# Altium schematic sheet Sch3.SchDoc
size A3
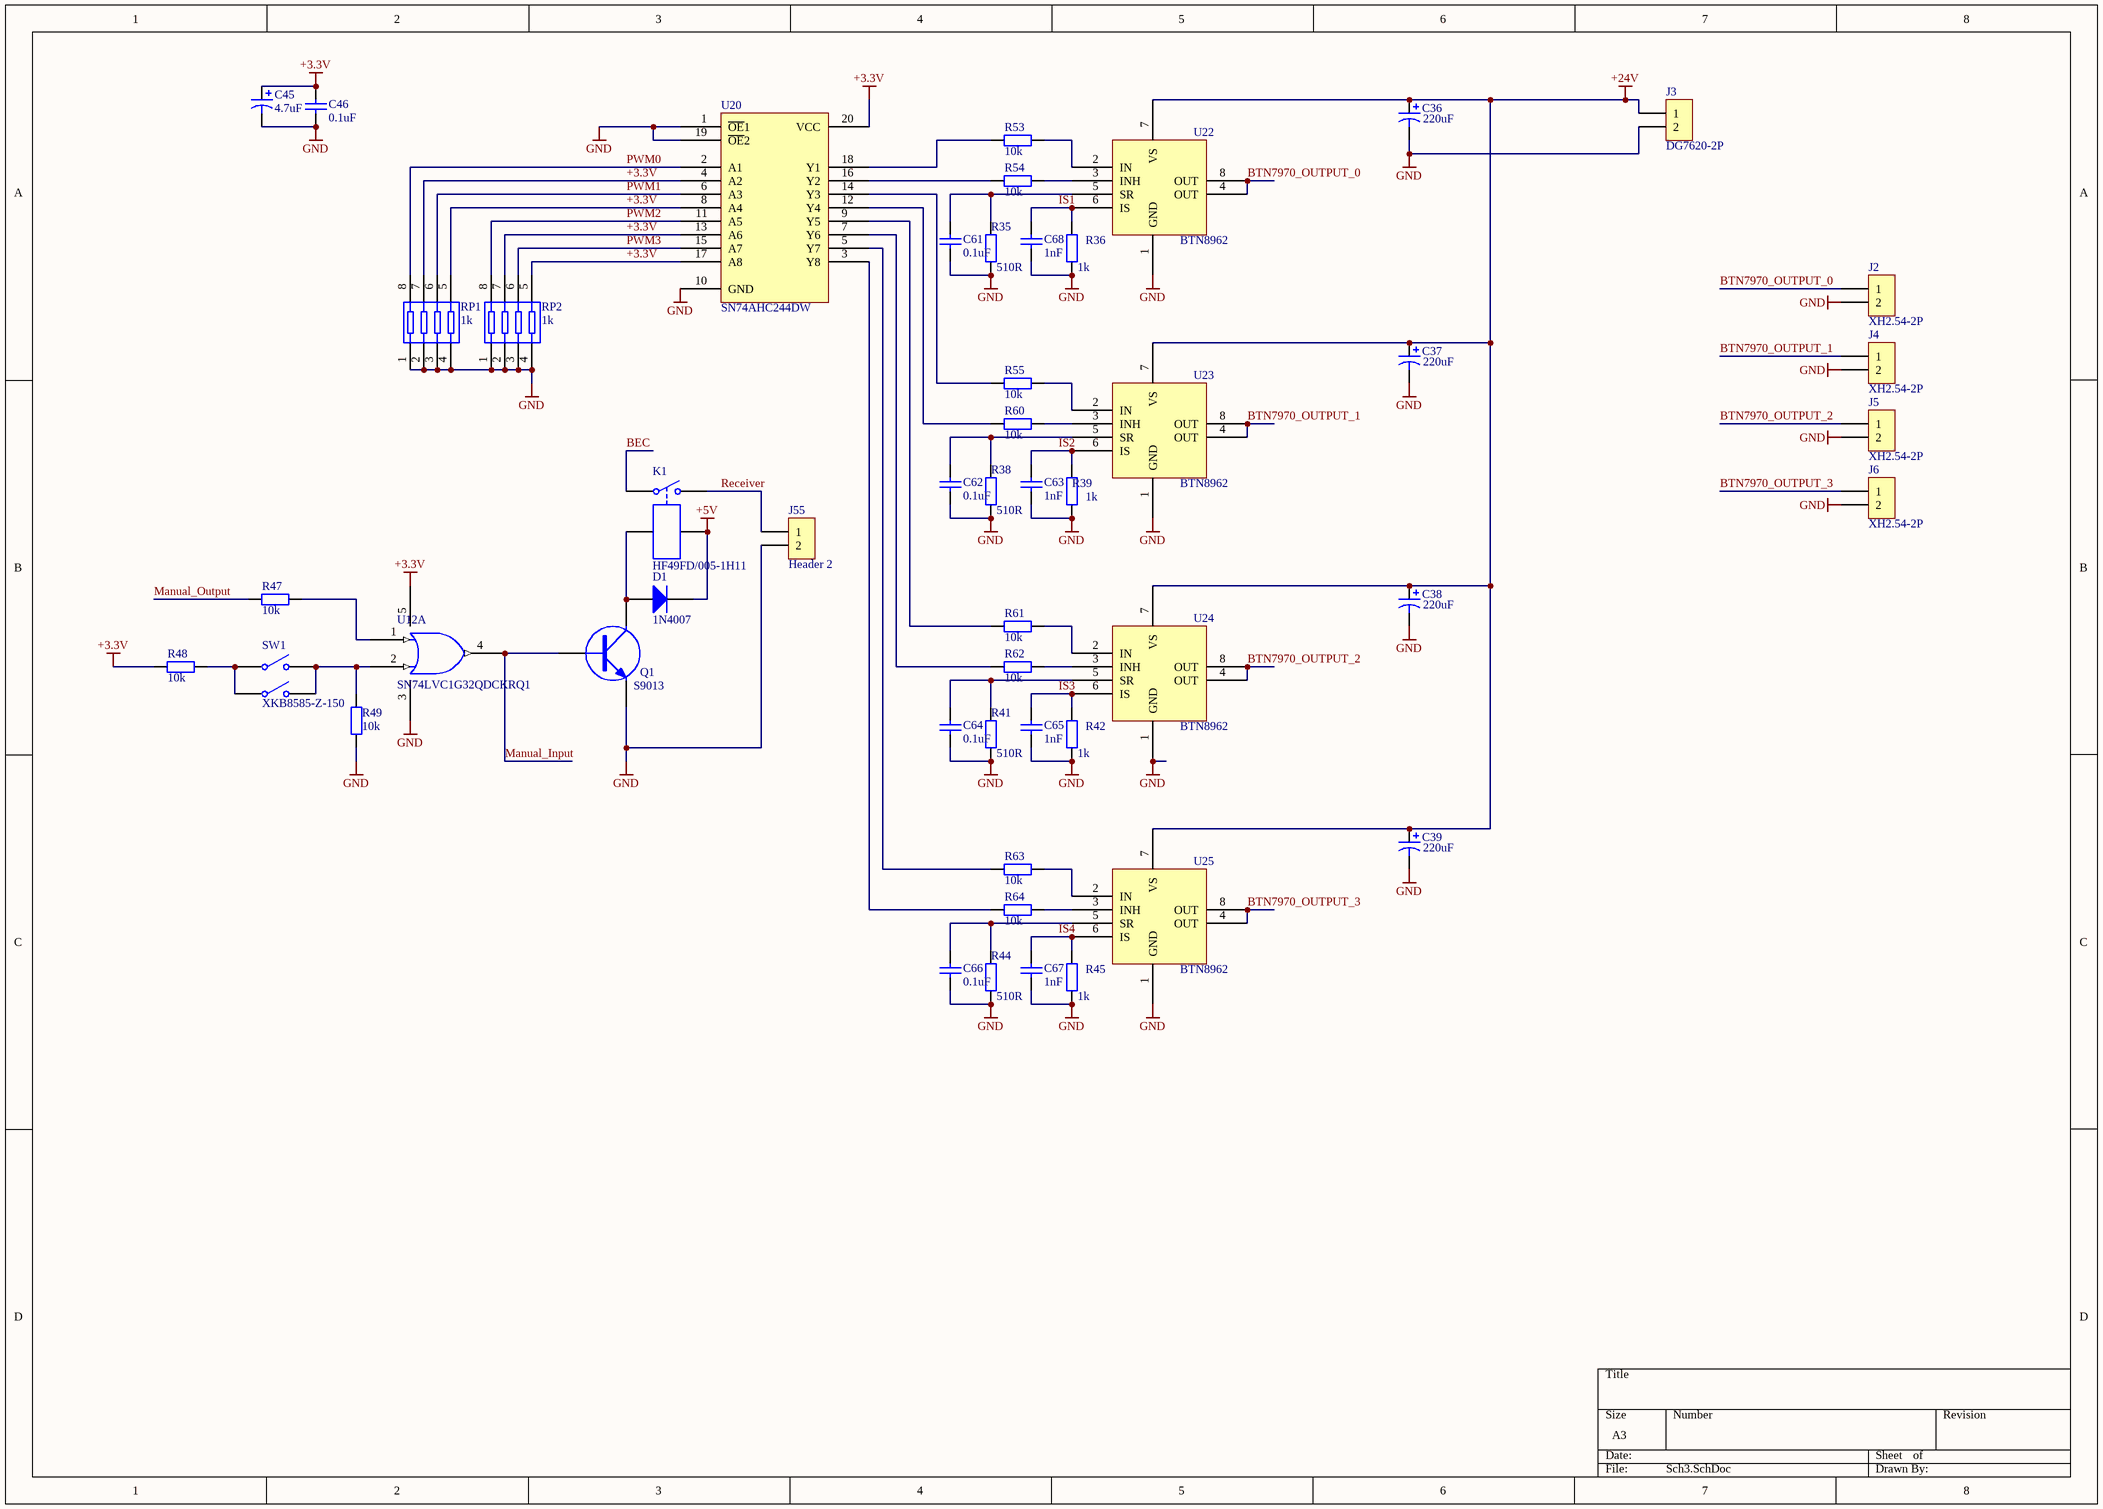
[diagram p0: Sch3.SchDoc]

## Parts
C36  value 220uF  [SMD-EC-F8]  (hidden comment: CD-50V-220uF-F8(SMD))
C37  value 220uF  [SMD-EC-F8]  (hidden comment: CD-50V-220uF-F8(SMD))
C38  value 220uF  [SMD-EC-F8]  (hidden comment: CD-50V-220uF-F8(SMD))
C39  value 220uF  [SMD-EC-F8]  (hidden comment: CD-50V-220uF-F8(SMD))
C45  value 4.7uF  [SMD-EC-F5]  (hidden comment: CD-50V-4.7uF-F5(SMD))
C46  value 0.1uF  [CC0603]  (hidden comment: 0603-50V-0.1uF)
C61  value 0.1uF  [CC0603]  (hidden comment: 0603-50V-0.1uF)
C62  value 0.1uF  [CC0603]  (hidden comment: 0603-50V-0.1uF)
C63  value 1nF  [CC0603]  (hidden comment: 0603-50V-1nF)
C64  value 0.1uF  [CC0603]  (hidden comment: 0603-50V-0.1uF)
C65  value 1nF  [CC0603]  (hidden comment: 0603-50V-1nF)
C66  value 0.1uF  [CC0603]  (hidden comment: 0603-50V-0.1uF)
C67  value 1nF  [CC0603]  (hidden comment: 0603-50V-1nF)
C68  value 1nF  [CC0603]  (hidden comment: 0603-50V-1nF)
D1  value 1N4007  [1N4007]  (hidden comment: 1N4007(SOD-123FL))
J2  XH2.54-2P  [XH2.54-2P]
J3  DG7620-2P  [DG7620-2P]
J4  XH2.54-2P  [XH2.54-2P]
J5  XH2.54-2P  [XH2.54-2P]
J6  XH2.54-2P  [XH2.54-2P]
J55  Header 2  [HDR1X2]
K1  HF49FD/005-1H11  [HF49FD]
Q1  value S9013  [SOT23]  (hidden comment: S9013(SOT-23))
R35  value 510R  [0603]  (hidden comment: 0603-510Ω±1％)
R36  value 1k  [0603]  (hidden comment: 0603-1kΩ±1％)
R38  value 510R  [0603]  (hidden comment: 0603-510Ω±1％)
R39  value 1k  [0603]  (hidden comment: 0603-1kΩ±1％)
R41  value 510R  [0603]  (hidden comment: 0603-510Ω±1％)
R42  value 1k  [0603]  (hidden comment: 0603-1kΩ±1％)
R44  value 510R  [0603]  (hidden comment: 0603-510Ω±1％)
R45  value 1k  [0603]  (hidden comment: 0603-1kΩ±1％)
R47  value 10k  [0603]  (hidden comment: 0603-10kΩ±1％)
R48  value 10k  [0603]  (hidden comment: 0603-10kΩ±1％)
R49  value 10k  [0603]  (hidden comment: 0603-10kΩ±1％)
R53  value 10k  [0603]  (hidden comment: 0603-10kΩ±1％)
R54  value 10k  [0603]  (hidden comment: 0603-10kΩ±1％)
R55  value 10k  [0603]  (hidden comment: 0603-10kΩ±1％)
R60  value 10k  [0603]  (hidden comment: 0603-10kΩ±1％)
R61  value 10k  [0603]  (hidden comment: 0603-10kΩ±1％)
R62  value 10k  [0603]  (hidden comment: 0603-10kΩ±1％)
R63  value 10k  [0603]  (hidden comment: 0603-10kΩ±1％)
R64  value 10k  [0603]  (hidden comment: 0603-10kΩ±1％)
RP1  value 1k  [RP8F]  (hidden comment: 0603-1kΩ-2*4P)
RP2  value 1k  [RP8F]  (hidden comment: 0603-1kΩ-2*4P)
SW1  XKB8585-Z-150  [KEY_SWITCH]
U12  SN74LVC1G32QDCKRQ1  [SC70-5]  (part A of 4)
U20  SN74AHC244DW  [SOP-20]
U22  BTN8962  [BTN7970]
U23  BTN8962  [BTN7970]
U24  BTN8962  [BTN7970]
U25  BTN8962  [BTN7970]

## Nets
+3.3V: C45.1 C46.2 R48.2 RP1.5 RP1.7 RP2.5 RP2.7 U12.5(VCC) U20.4(A2) U20.8(A4) U20.13(A6) U20.17(A8) U20.20(VCC)  [also labelled VCC]
+5V: D1.2(K) K1.2
+24V: C36.1 C37.1 C38.1 C39.1 J3.1 U22.7(VS) U23.7(VS) U24.7(VS) U25.7(VS)
GND: C36.2 C37.2 C38.2 C39.2 C45.2 C46.1 C61.1 C62.1 C63.1 C64.1 C65.1 C66.1 C67.1 C68.1 J2.2 J3.2 J4.2 J5.2 J6.2 J55.2 Q1.2(E) R35.1 R36.1 R38.1 R39.1 R41.1 R42.1 R44.1 R45.1 R49.2 RP1.1 RP1.2 RP1.3 RP1.4 RP2.1 RP2.2 RP2.3 RP2.4 U12.3(GND) U20.1(~{OE}1) U20.10(GND) U20.19(~{OE}2) U22.1(GND) U23.1(GND) U24.1(GND) U25.1(GND)
BEC: K1.3
BTN7970_OUTPUT_0: J2.1 U22.4(OUT) U22.8(OUT)
BTN7970_OUTPUT_1: J4.1 U23.4(OUT) U23.8(OUT)
BTN7970_OUTPUT_2: J5.1 U24.4(OUT) U24.8(OUT)
BTN7970_OUTPUT_3: J6.1 U25.4(OUT) U25.8(OUT)
IS1: C68.2 R36.2 U22.6(IS)
IS2: C63.2 R39.2 U23.6(IS)
IS3: C65.2 R42.2 U24.6(IS)
IS4: C67.2 R45.2 U25.6(IS)
Manual_Input: Q1.1(B) U12.4
Manual_Output: R47.2
PWM0: RP1.8 U20.2(A1)
PWM1: RP1.6 U20.6(A3)
PWM2: RP2.8 U20.11(A5)
PWM3: RP2.6 U20.15(A7)
Receiver: J55.1 K1.4
NetC61_2: C61.2 R35.2 U22.5(SR)
NetC62_2: C62.2 R38.2 U23.5(SR)
NetC64_2: C64.2 R41.2 U24.5(SR)
NetC66_2: C66.2 R44.2 U25.5(SR)
NetD1_1: D1.1(A) K1.1 Q1.3(C)
NetR47_1: R47.1 U12.1
NetR48_1: R48.1 SW1.1(COMMON) SW1.6(COMMON)
NetR49_1: R49.1 SW1.2(NO) SW1.5(NO) U12.2
NetR53_1: R53.1 U20.18(Y1)
NetR53_2: R53.2 U22.2(IN)
NetR54_1: R54.1 U20.16(Y2)
NetR54_2: R54.2 U22.3(INH)
NetR55_1: R55.1 U20.14(Y3)
NetR55_2: R55.2 U23.2(IN)
NetR60_1: R60.1 U20.12(Y4)
NetR60_2: R60.2 U23.3(INH)
NetR61_1: R61.1 U20.9(Y5)
NetR61_2: R61.2 U24.2(IN)
NetR62_1: R62.1 U20.7(Y6)
NetR62_2: R62.2 U24.3(INH)
NetR63_1: R63.1 U20.5(Y7)
NetR63_2: R63.2 U25.2(IN)
NetR64_1: R64.1 U20.3(Y8)
NetR64_2: R64.2 U25.3(INH)

## Library data of the parts
C36-C39 = Cap Pol3: 贴片铝电解电容
C45 = Cap Pol1: 贴片铝电解电容
C46 C61-C68 = Cap: 贴片电容
D1 = Diode: 贴片二极管
J2-J6 = CON2: 插座
  J2 J4-J6: Value: XH2.54-2P
  J3: Value: DG7620-2P
J55 = CON2: 排针; Value: 2.54mm 2P单排针
K1 = Relay-SPST: Single-Pole Single-Throw Relay; Value: HF49FD/005-1H11
Q1 = S9013: 贴片三极管
R35 R36 R38 R39 R41 R42 R44 R45 R47-R49 R53-R55 R60-R64 = Res2: 贴片电阻
RP1 RP2 = RESPACK: 排阻
SW1 = SW-SPST: 开关; Value: XKB8585-Z-150
U12 = 74LS32: 集成电路; Value: SN74LVC1G32QDCKRQ1
U20 = SN74AHC244DW: 集成电路; Value: SN74AHC244DW
U22-U25 = BTN7970: 集成电路
  U22: Value: BTN7970
  U23-U25: Value: BTN8962